# EAGLE design esp_converter (EAGLE 6.3)
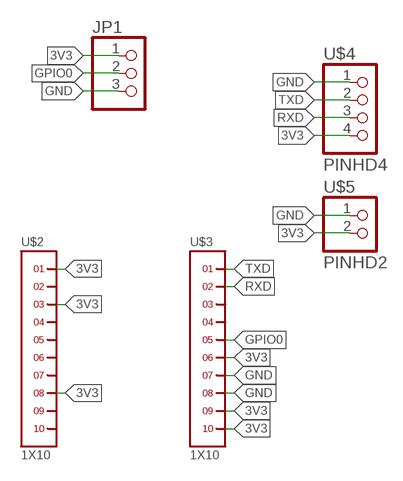
[diagram p0: schematic, sheet 1]

## Parts
JP1  PINHD-1X3  [1X03]
U$2  1X10  [1X10]
U$3  1X10  [1X10]
U$4  PINHD4  [PINHD4]
U$5  PINHD2  [PINHD2]

## Nets
3V3: JP1.1 U$2.1 U$2.3 U$2.8 U$3.6 U$3.9 U$3.10 U$4.4 U$5.2
GND: JP1.3 U$3.7 U$3.8 U$4.1 U$5.1
GPIO0: JP1.2 U$3.5
RXD: U$3.2 U$4.3
TXD: U$3.1 U$4.2
Unconnected: U$2.2 U$2.4 U$2.5 U$2.6 U$2.7 U$2.9 U$2.10 U$3.3 U$3.4

## Library data of the parts
JP1 = adafruit:PINHD-1X3: PIN HEADER
U$2 U$3 = header2mm:1X10
U$4 = TFT_LCD_2.2:PINHD4: Pin Head 1x4 Holes 2.54 mm
U$5 = TFT_LCD_2.2:PINHD2: Pin Head 1x2 Holes 2.54 mm

## Board
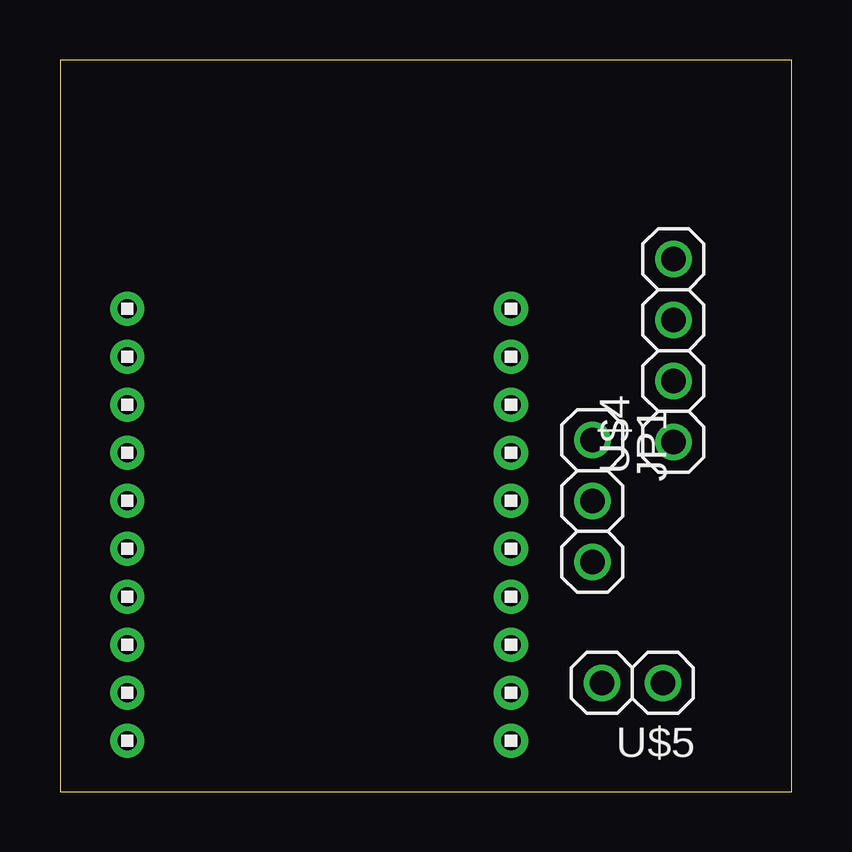
[diagram p1: board, top side]
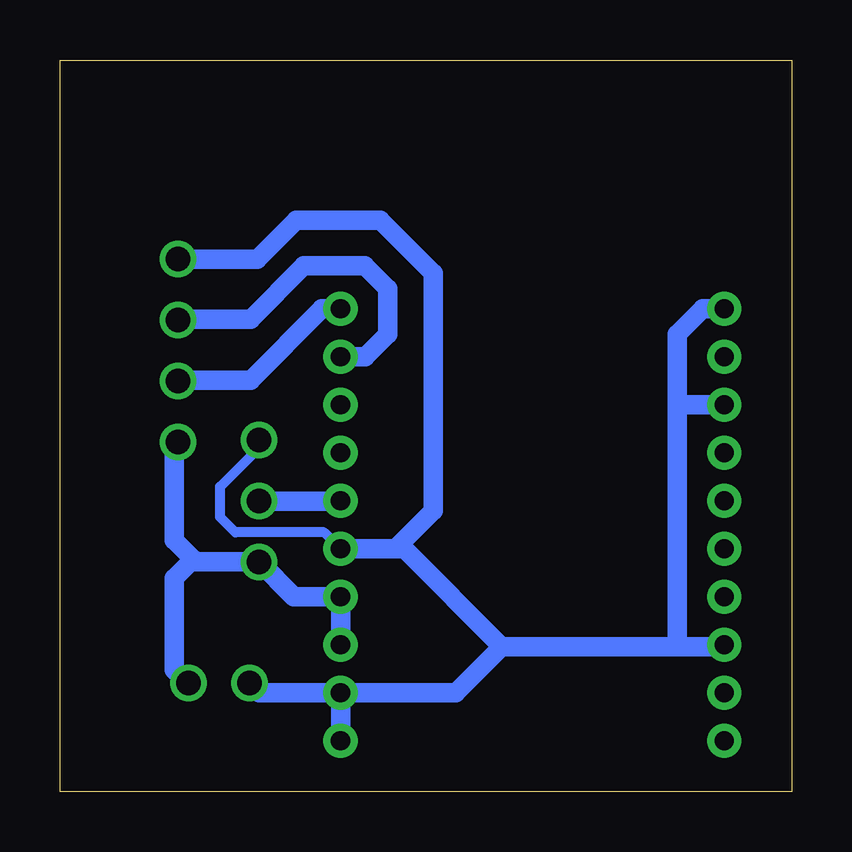
[diagram p2: board, bottom side, seen from below]

Size 30.48 x 30.48 mm. Coordinates in mm from the lower left corner, seen from the top.
Outline: 0,0 30.48,0 30.48,30.48 0,30.48 0,0
Copper layers (1*16): Top 0.035mm / dielectric 1.5mm / Bottom 0.035mm
Design rules "default": minimum track width 10mil, minimum drill 24mil, track to track 8mil, track to pad 8mil, pad to pad 8mil, via to via 8mil, smd to smd 8mil, copper to edge 40mil, drill to drill 8mil, minimum pad ring 10mil, minimum via ring 8mil, stop-mask expansion 4mil, vias tented up to drill 0mil, thermal gap 10mil

### Footprints (pad centres in the part's own frame; a part is rotated, then mirrored left to right if it is on the bottom)
1X03 = drill 1.016: 1 -2.54,0; 2 0,0; 3 2.54,0
1X10 = drill 0.8 pad 1.422: 1 -9,0; 2 -7,0; 3 -5,0; 4 -3,0; 5 -1,0; 6 1,0; 7 3,0; 8 5,0; 9 7,0; 10 9,0
PINHD4 = drill 1.016: 1 -3.81,0; 2 -1.27,0; 3 1.27,0; 4 3.81,0
PINHD2 = drill 1.016: 1 -1.27,0; 2 1.27,0

### Placement (x,y rotation side)
JP1  22.19,12.1 270 top
U$2  2.8,11.11 270 top
U$3  18.79,11.11 270 top
U$4  25.56,18.38 90 top
U$5  23.85,4.52 180 top

### Tracks (layer width: path | path; a pad name or v marks a point on that pad's centre or on a via)
3V3
  Bottom 0.406: U$3.6 19.48,10.79 23.18,10.79 23.81,11.43 23.81,12.7 22.18,14.33 JP1.1
  Bottom 0.813: 18.84,10.16 U$3.6 16.51,10.11 | 16.51,10.11 16.14,10.11 12.06,6.03 | 12.06,6.03 4.76,6.03 | 4.76,6.03 2.88,6.03 U$2.8 | 4.76,6.03 4.76,15.88 | 4.76,15.88 4.76,19.05 3.7,20.11 U$2.1 | U$2.3 4.53,16.11 4.76,15.88 | U$4.4 22.27,22.18 20.64,23.81 17.14,23.81 14.92,21.59 14.92,11.7 16.51,10.11 | U$3.9 22.17,4.11 U$5.2 | U$3.9 13.98,4.11 12.06,6.03 | U$3.10 U$3.9
GND
  Bottom 0.813: U$3.8 U$3.7 20.73,8.11 JP1.3 24.8,9.56 24.92,9.68 | 24.92,9.68 25.72,10.48 25.72,14.41 U$4.1 | U$5.1 25.16,4.52 25.72,5.08 25.72,8.89 24.92,9.68
GPIO0
  Bottom 0.813: JP1.2 U$3.5
RXD
  Bottom 0.813: U$3.2 17.77,18.11 16.83,19.05 16.83,20.95 17.78,21.91 20.32,21.91 22.54,19.68 25.52,19.68 U$4.3
TXD
  Bottom 0.813: U$3.1 19.57,20.11 22.54,17.14 25.52,17.14 U$4.2